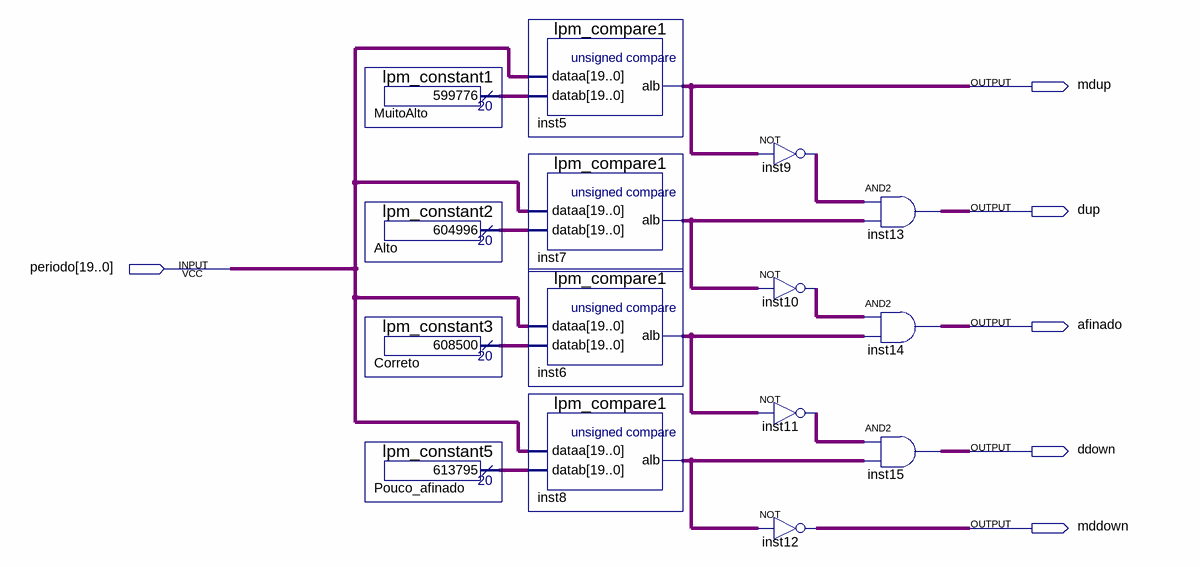
[diagram p0: schematic sheet]
// Quartus schematic Comparador.bdf as structural Verilog: 15 symbols, 6 pins
module Comparador (
  input  [19:0] periodo,
  output mdup,
  output dup,
  output afinado,
  output ddown,
  output mddown
);

  wire inst6_alb, inst7_alb, inst8_alb, inst9_out, inst10_out, inst11_out;
  wire [19:0] Alto_result, Correto_result, MuitoAlto_result, Pouco_afinado_result;

  lpm_constant1 MuitoAlto (.result(MuitoAlto_result));
  lpm_constant2 Alto (.result(Alto_result));
  lpm_constant3 Correto (.result(Correto_result));
  lpm_constant5 Pouco_afinado (.result(Pouco_afinado_result));
  lpm_compare1 inst5 (.dataa(periodo), .datab(MuitoAlto_result), .alb(mdup));
  lpm_compare1 inst7 (.dataa(periodo), .datab(Alto_result), .alb(inst7_alb));
  lpm_compare1 inst6 (.dataa(periodo), .datab(Correto_result), .alb(inst6_alb));
  lpm_compare1 inst8 (.dataa(periodo), .datab(Pouco_afinado_result), .alb(inst8_alb));
  not inst9 (inst9_out, mdup);
  not inst10 (inst10_out, inst7_alb);
  not inst11 (inst11_out, inst6_alb);
  not inst12 (mddown, inst8_alb);
  and inst13 (dup, inst9_out, inst7_alb);
  and inst14 (afinado, inst10_out, inst6_alb);
  and inst15 (ddown, inst11_out, inst8_alb);
endmodule
